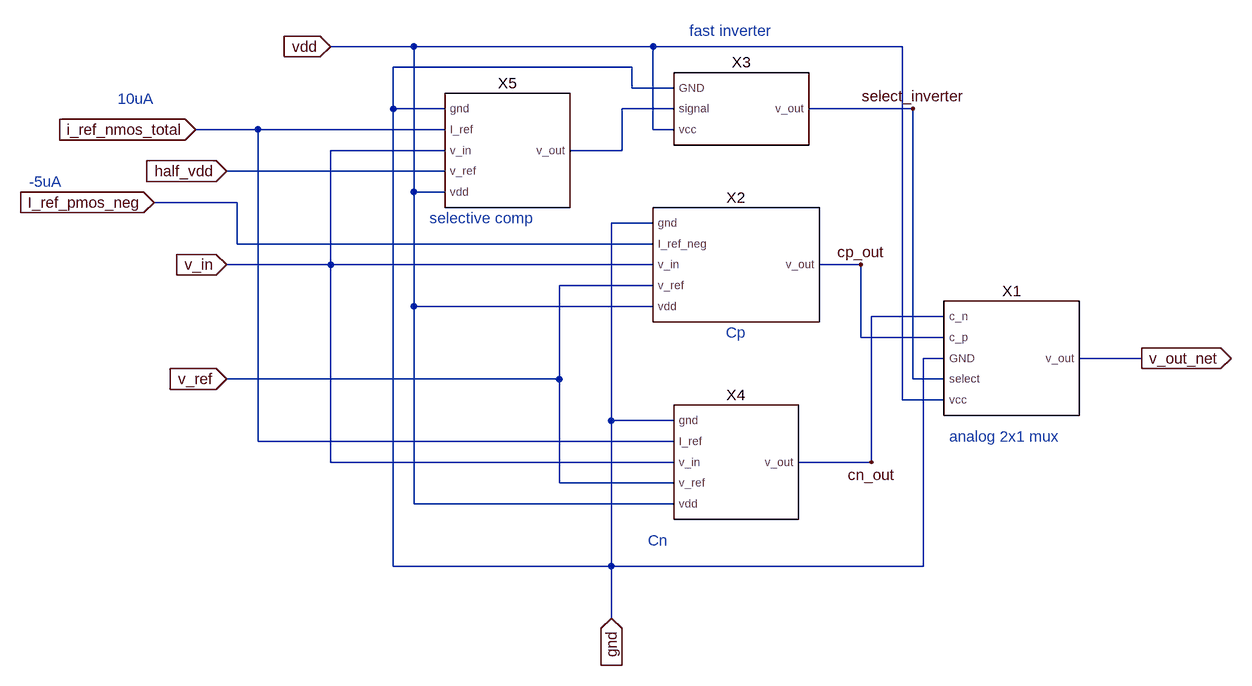
[diagram p0: schematic cp_cn_selective_comp_new_ckt.asc]
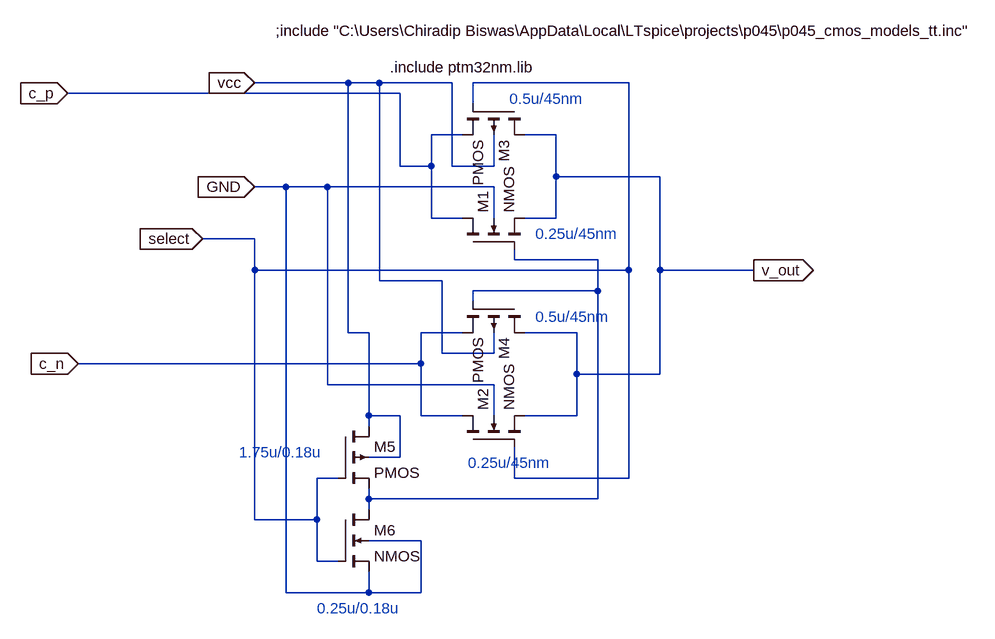
[diagram p1: sub-circuit analog_2_to_1mux.asc]
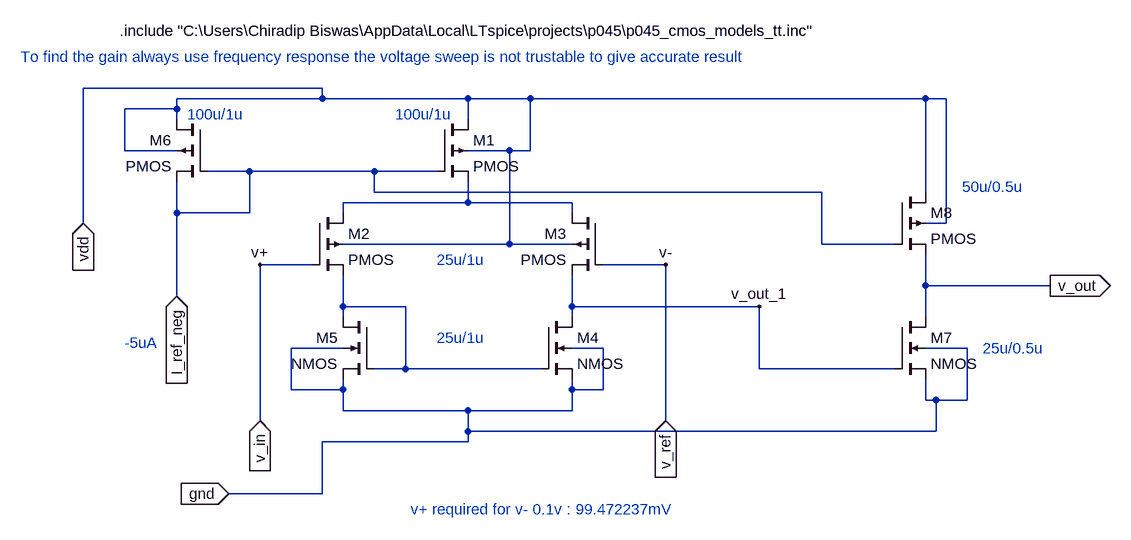
[diagram p2: sub-circuit static_comparator_pmosbased_ckt.asc]
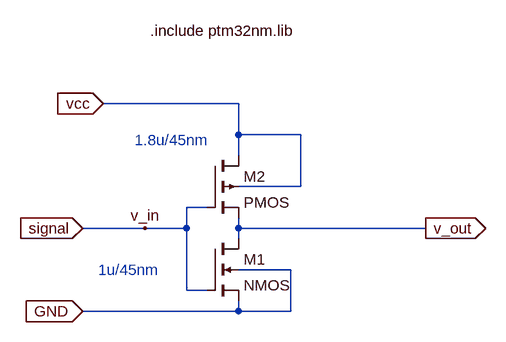
[diagram p3: sub-circuit fast_inverterckt.asc]
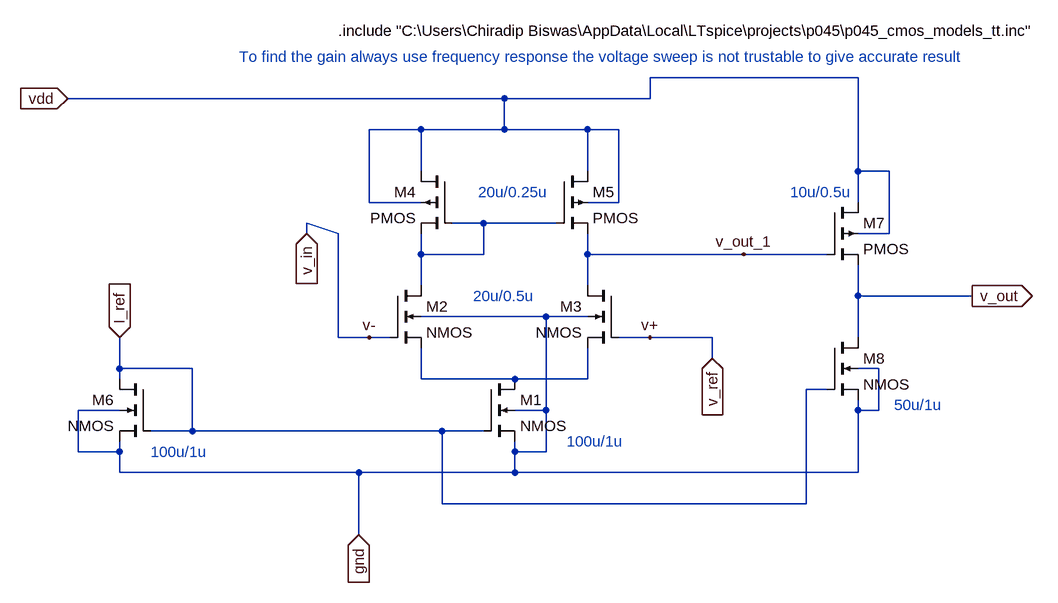
[diagram p4: sub-circuit static_comparator_nmos_based_ckt.asc]
cp_cn_selective_comp_new_ckt.asc, the LTspice schematic file:
Version 4
SHEET 1 2192 824
WIRE 896 -160 768 -160
WIRE 1264 -160 896 -160
WIRE 1648 -160 1264 -160
WIRE 1232 -128 864 -128
WIRE 1232 -96 1232 -128
WIRE 1296 -96 1232 -96
WIRE 864 -64 864 -128
WIRE 944 -64 864 -64
WIRE 1296 -64 1216 -64
WIRE 1664 -64 1504 -64
WIRE 656 -32 560 -32
WIRE 944 -32 656 -32
WIRE 1264 -32 1264 -160
WIRE 1296 -32 1264 -32
WIRE 944 0 768 0
WIRE 1216 0 1216 -64
WIRE 1216 0 1136 0
WIRE 944 32 608 32
WIRE 896 64 896 -160
WIRE 944 64 896 64
WIRE 624 80 496 80
WIRE 1264 112 1200 112
WIRE 624 144 624 80
WIRE 1264 144 624 144
WIRE 768 176 768 0
WIRE 768 176 608 176
WIRE 1264 176 768 176
WIRE 1584 176 1520 176
WIRE 1264 208 1120 208
WIRE 896 240 896 64
WIRE 1264 240 896 240
WIRE 1712 256 1600 256
WIRE 1584 288 1584 176
WIRE 1712 288 1584 288
WIRE 1712 320 1680 320
WIRE 2016 320 1920 320
WIRE 1120 352 1120 208
WIRE 1120 352 608 352
WIRE 1664 352 1664 -64
WIRE 1712 352 1664 352
WIRE 1648 384 1648 -160
WIRE 1712 384 1648 384
WIRE 1200 416 1200 112
WIRE 1296 416 1200 416
WIRE 656 448 656 -32
WIRE 1296 448 656 448
WIRE 768 480 768 176
WIRE 1296 480 768 480
WIRE 1600 480 1600 256
WIRE 1600 480 1488 480
WIRE 1120 512 1120 352
WIRE 1296 512 1120 512
WIRE 896 544 896 240
WIRE 1296 544 896 544
WIRE 864 640 864 -64
WIRE 1200 640 1200 416
WIRE 1200 640 864 640
WIRE 1680 640 1680 320
WIRE 1680 640 1200 640
WIRE 1200 720 1200 640
FLAG 768 -160 vdd
IOPIN 768 -160 In
FLAG 2016 320 v_out_net
IOPIN 2016 320 Out
FLAG 1200 720 gnd
IOPIN 1200 720 In
FLAG 560 -32 i_ref_nmos_total
IOPIN 560 -32 In
FLAG 608 32 half_vdd
IOPIN 608 32 In
FLAG 608 176 v_in
IOPIN 608 176 In
FLAG 608 352 v_ref
IOPIN 608 352 In
FLAG 496 80 I_ref_pmos_neg
IOPIN 496 80 In
FLAG 1584 176 cp_out
FLAG 1600 480 cn_out
FLAG 1664 -64 select_inverter
SYMBOL analog_2_to_1mux 1808 320 R0
SYMATTR InstName X1
SYMBOL static_comparator_pmosbased_ckt 1392 176 R0
SYMATTR InstName X2
SYMBOL fast_inverterCKT 1392 -64 R0
SYMATTR InstName X3
SYMBOL static_comparator_nmos_based_ckt 1392 480 R0
SYMATTR InstName X4
SYMBOL static_comparator_nmos_based_ckt 1040 0 R0
SYMATTR InstName X5
TEXT 1376 280 Left 2 ;Cp
TEXT 920 104 Left 2 ;selective comp
TEXT 1720 440 Left 2 ;analog 2x1 mux
TEXT 1256 600 Left 2 ;Cn
TEXT 1320 -184 Left 2 ;fast inverter
TEXT 440 -80 Left 2 ;10uA
TEXT 304 48 Left 2 ;-5uA

analog_2_to_1mux.asc, the sub-circuit schematic file:
Version 4
SHEET 1 1128 872
WIRE 32 48 -112 48
WIRE 80 48 32 48
WIRE 192 48 80 48
WIRE 464 48 224 48
WIRE 112 64 -400 64
WIRE 224 80 224 48
WIRE 208 128 160 128
WIRE 352 128 304 128
WIRE 112 176 112 64
WIRE 160 176 160 128
WIRE 160 176 112 176
WIRE 192 176 192 48
WIRE 256 176 256 128
WIRE 256 176 192 176
WIRE 352 192 352 128
WIRE 512 192 352 192
WIRE -64 208 -112 208
WIRE 0 208 -64 208
WIRE 256 208 0 208
WIRE 160 256 160 176
WIRE 208 256 160 256
WIRE 256 256 256 208
WIRE 352 256 352 192
WIRE 352 256 304 256
WIRE -112 288 -192 288
WIRE 288 320 288 304
WIRE 416 320 288 320
WIRE -112 336 -112 288
WIRE 464 336 464 48
WIRE 464 336 -112 336
WIRE 512 336 512 192
WIRE 656 336 512 336
WIRE 80 352 80 48
WIRE 176 352 80 352
WIRE 416 368 416 320
WIRE 416 368 224 368
WIRE 224 384 224 368
WIRE 32 432 32 48
WIRE 64 432 32 432
WIRE 208 432 144 432
WIRE 384 432 304 432
WIRE 176 464 176 352
WIRE 256 464 256 432
WIRE 256 464 176 464
WIRE 144 480 144 432
WIRE 144 480 -384 480
WIRE 384 496 384 432
WIRE 512 496 512 336
WIRE 512 496 384 496
WIRE 0 512 0 208
WIRE 256 512 0 512
WIRE 64 560 64 432
WIRE 112 560 64 560
WIRE 144 560 144 480
WIRE 208 560 144 560
WIRE 256 560 256 512
WIRE 384 560 384 496
WIRE 384 560 304 560
WIRE 64 576 64 560
WIRE 112 624 112 560
WIRE 112 624 64 624
WIRE 16 656 -16 656
WIRE 288 656 288 608
WIRE 464 656 464 336
WIRE 464 656 288 656
WIRE 64 688 64 672
WIRE 416 688 416 368
WIRE 416 688 64 688
WIRE 64 704 64 688
WIRE -112 720 -112 336
WIRE -16 720 -16 656
WIRE -16 720 -112 720
WIRE 144 752 64 752
WIRE -16 784 -16 720
WIRE 16 784 -16 784
WIRE -64 832 -64 208
WIRE 64 832 64 800
WIRE 64 832 -64 832
WIRE 144 832 144 752
WIRE 144 832 64 832
FLAG 656 336 v_out
IOPIN 656 336 Out
FLAG -192 288 select
IOPIN -192 288 In
FLAG -400 64 c_p
IOPIN -400 64 In
FLAG -384 480 c_n
IOPIN -384 480 In
FLAG -112 208 GND
IOPIN -112 208 In
FLAG -112 48 vcc
IOPIN -112 48 In
SYMBOL nmos4 208 304 R270
SYMATTR InstName M1
SYMATTR Value2 l=45nm w=0.25u
SYMBOL nmos4 208 608 R270
SYMATTR InstName M2
SYMATTR Value2 l=45nm w=0.25u
SYMBOL pmos4 304 80 R90
SYMATTR InstName M3
SYMATTR Value2 l=45nm w=0.5u
SYMBOL pmos4 304 384 R90
SYMATTR InstName M4
SYMATTR Value2 l=45nm w=0.5u
SYMBOL pmos4 16 576 R0
SYMATTR InstName M5
SYMATTR Value2 l=0.18u w=1.75u
SYMBOL nmos4 16 704 R0
SYMATTR InstName M6
SYMATTR Value2 l=0.18u w=0.25u
TEXT 96 24 Left 2 !.include ptm32nm.lib
TEXT 280 72 Left 2 ;0.5u/45nm
TEXT 320 408 Left 2 ;0.5u/45nm
TEXT 320 280 Left 2 ;0.25u/45nm
TEXT 216 632 Left 2 ;0.25u/45nm
TEXT -136 616 Left 2 ;1.75u/0.18u
TEXT -16 856 Left 2 ;0.25u/0.18u
TEXT -80 -32 Left 2 !;include "C:\\Users\\Chiradip Biswas\\AppData\\Local\\LTspice\\projects\\p045\\p045_cmos_models_tt.inc"

static_comparator_pmosbased_ckt.asc, the sub-circuit schematic file:
Version 4
SHEET 1 1308 712
WIRE 64 0 -304 0
WIRE 64 16 64 0
WIRE 64 16 -160 16
WIRE 288 16 64 16
WIRE 384 16 288 16
WIRE 992 16 384 16
WIRE 1024 16 992 16
WIRE -160 32 -160 16
WIRE -160 32 -240 32
WIRE -160 48 -160 32
WIRE 288 48 288 16
WIRE -240 96 -240 32
WIRE -160 96 -240 96
WIRE 352 96 288 96
WIRE 384 96 384 16
WIRE 384 96 352 96
WIRE -48 128 -112 128
WIRE 144 128 -48 128
WIRE 240 128 144 128
WIRE 144 160 144 128
WIRE 832 160 144 160
WIRE 992 160 992 16
WIRE 288 176 288 144
WIRE 288 176 96 176
WIRE 448 176 288 176
WIRE -160 192 -160 144
WIRE -48 192 -48 128
WIRE -48 192 -160 192
WIRE 96 192 96 176
WIRE 448 192 448 176
WIRE -304 208 -304 0
WIRE 1024 208 1024 16
WIRE 1024 208 992 208
WIRE 352 240 352 96
WIRE 352 240 96 240
WIRE 448 240 352 240
WIRE 832 240 832 160
WIRE 944 240 832 240
WIRE 48 272 -32 272
WIRE 592 272 496 272
WIRE 992 304 992 256
WIRE 1184 304 992 304
WIRE -160 320 -160 192
WIRE 96 336 96 288
WIRE 192 336 96 336
WIRE 448 336 448 288
WIRE 736 336 448 336
WIRE 96 352 96 336
WIRE 448 352 448 336
WIRE 992 352 992 304
WIRE 96 400 16 400
WIRE 496 400 448 400
WIRE 1056 400 992 400
WIRE 192 432 192 336
WIRE 192 432 144 432
WIRE 400 432 192 432
WIRE 736 432 736 336
WIRE 944 432 736 432
WIRE 16 464 16 400
WIRE 96 464 96 448
WIRE 96 464 16 464
WIRE 448 464 448 448
WIRE 496 464 496 400
WIRE 496 464 448 464
WIRE 992 480 992 448
WIRE 1008 480 992 480
WIRE 1056 480 1056 400
WIRE 1056 480 1008 480
WIRE 96 496 96 464
WIRE 288 496 96 496
WIRE 448 496 448 464
WIRE 448 496 288 496
WIRE -32 512 -32 272
WIRE 592 512 592 272
WIRE 288 528 288 496
WIRE 1008 528 1008 480
WIRE 1008 528 288 528
WIRE 288 544 288 528
WIRE 288 544 64 544
WIRE 64 624 64 544
WIRE 64 624 -80 624
FLAG 736 336 v_out_1
FLAG 592 272 v-
FLAG -32 272 v+
FLAG 1184 304 v_out
IOPIN 1184 304 Out
FLAG 592 512 v_ref
IOPIN 592 512 In
FLAG -32 512 v_in
IOPIN -32 512 In
FLAG -160 320 I_ref_neg
IOPIN -160 320 In
FLAG -304 208 vdd
IOPIN -304 208 In
FLAG -80 624 gnd
IOPIN -80 624 In
SYMBOL pmos4 240 48 R0
SYMATTR InstName M1
SYMATTR Value2 l=1u w=100u
SYMBOL pmos4 48 192 R0
SYMATTR InstName M2
SYMATTR Value2 l=1u w=25u
SYMBOL pmos4 496 192 M0
SYMATTR InstName M3
SYMATTR Value2 l=1u w=25u
SYMBOL nmos4 400 352 R0
SYMATTR InstName M4
SYMATTR Value2 l=1u w=25u
SYMBOL nmos4 144 352 M0
SYMATTR InstName M5
SYMATTR Value2 l=1u w=25u
SYMBOL pmos4 -112 48 M0
SYMATTR InstName M6
SYMATTR Value2 l=1u w=100u
SYMBOL nmos4 944 352 R0
SYMATTR InstName M7
SYMATTR Value2 l=0.5u w=25u
SYMBOL pmos4 944 160 R0
SYMATTR InstName M8
SYMATTR Value2 l=0.5u w=50u
TEXT -248 -88 Left 2 !.include "C:\\Users\\Chiradip Biswas\\AppData\\Local\\LTspice\\projects\\p045\\p045_cmos_models_tt.inc"
TEXT -400 -48 Left 2 ;To find the gain always use frequency response the voltage sweep is not trustable to give accurate result
TEXT 240 264 Left 2 ;25u/1u
TEXT 176 40 Left 2 ;100u/1u
TEXT -144 40 Left 2 ;100u/1u
TEXT 240 384 Left 2 ;25u/1u
TEXT 1048 152 Left 2 ;50u/0.5u
TEXT 1080 400 Left 2 ;25u/0.5u
TEXT 200 648 Left 2 ;v+ required for v- 0.1v : 99.472237mV
TEXT -240 392 Left 2 ;-5uA

fast_inverterckt.asc, the sub-circuit schematic file:
Version 4
SHEET 1 1464 680
WIRE 352 32 144 32
WIRE 352 80 352 32
WIRE 448 80 352 80
WIRE 352 112 352 80
WIRE 448 160 448 80
WIRE 448 160 352 160
WIRE 304 192 272 192
WIRE 208 224 112 224
WIRE 272 224 272 192
WIRE 272 224 208 224
WIRE 352 224 352 208
WIRE 640 224 352 224
WIRE 352 240 352 224
WIRE 432 288 352 288
WIRE 272 320 272 224
WIRE 304 320 272 320
WIRE 352 352 352 336
WIRE 352 352 112 352
WIRE 432 352 432 288
WIRE 432 352 352 352
FLAG 208 224 v_in
FLAG 144 32 vcc
IOPIN 144 32 In
FLAG 112 224 signal
IOPIN 112 224 In
FLAG 112 352 GND
IOPIN 112 352 In
FLAG 640 224 v_out
IOPIN 640 224 Out
SYMBOL nmos4 304 240 R0
SYMATTR InstName M1
SYMATTR Value2 l=45nm w=1u
SYMBOL pmos4 304 112 R0
SYMATTR InstName M2
SYMATTR Value2 l=45nm w=1.8u
TEXT 192 88 Left 2 ;1.8u/45nm
TEXT 136 288 Left 2 ;1u/45nm
TEXT 216 -80 Left 2 !.include ptm32nm.lib

static_comparator_nmos_based_ckt.asc, the sub-circuit schematic file:
Version 4
SHEET 1 1336 680
WIRE 928 -144 608 -144
WIRE 384 -112 -288 -112
WIRE 608 -112 608 -144
WIRE 608 -112 384 -112
WIRE 256 -64 176 -64
WIRE 384 -64 384 -112
WIRE 384 -64 256 -64
WIRE 512 -64 384 -64
WIRE 560 -64 512 -64
WIRE 256 0 256 -64
WIRE 512 0 512 -64
WIRE 928 0 928 -144
WIRE 976 0 928 0
WIRE 176 48 176 -64
WIRE 256 48 176 48
WIRE 560 48 560 -64
WIRE 560 48 512 48
WIRE 928 48 928 0
WIRE 352 80 304 80
WIRE 464 80 352 80
WIRE 80 96 80 80
WIRE 128 96 80 80
WIRE 976 96 976 0
WIRE 976 96 928 96
WIRE 256 128 256 96
WIRE 352 128 352 80
WIRE 352 128 256 128
WIRE 512 128 512 96
WIRE 752 128 512 128
WIRE 880 128 752 128
WIRE 256 176 256 128
WIRE 512 176 512 128
WIRE 928 192 928 144
WIRE 1104 192 928 192
WIRE 448 224 256 224
WIRE 512 224 448 224
WIRE 128 256 128 96
WIRE 176 256 128 256
WIRE 208 256 176 256
WIRE 608 256 560 256
WIRE 704 256 608 256
WIRE 928 256 928 192
WIRE 704 288 704 256
WIRE -208 304 -208 256
WIRE -96 304 -208 304
WIRE 960 304 928 304
WIRE -208 320 -208 304
WIRE 256 320 256 272
WIRE 400 320 256 320
WIRE 512 320 512 272
WIRE 512 320 400 320
WIRE 880 336 848 336
WIRE -208 368 -272 368
WIRE 448 368 448 224
WIRE 448 368 400 368
WIRE 928 368 928 352
WIRE 960 368 960 304
WIRE 960 368 928 368
WIRE -96 400 -96 304
WIRE -96 400 -160 400
WIRE 288 400 -96 400
WIRE 352 400 288 400
WIRE -272 432 -272 368
WIRE -208 432 -208 416
WIRE -208 432 -272 432
WIRE 400 432 400 416
WIRE 448 432 448 368
WIRE 448 432 400 432
WIRE -208 464 -208 432
WIRE 160 464 -208 464
WIRE 400 464 400 432
WIRE 400 464 160 464
WIRE 928 464 928 368
WIRE 928 464 400 464
WIRE 288 512 288 400
WIRE 848 512 848 336
WIRE 848 512 288 512
WIRE 160 560 160 464
FLAG 608 256 v+
FLAG 176 256 v-
FLAG 752 128 v_out_1
FLAG 1104 192 v_out
IOPIN 1104 192 Out
FLAG 704 288 v_ref
IOPIN 704 288 In
FLAG 80 96 v_in
IOPIN 80 96 In
FLAG -288 -112 vdd
IOPIN -288 -112 In
FLAG -208 256 I_ref
IOPIN -208 256 In
FLAG 160 560 gnd
IOPIN 160 560 In
SYMBOL nmos4 352 320 R0
SYMATTR InstName M1
SYMATTR Value2 l=1u w=100u
SYMBOL nmos4 208 176 R0
SYMATTR InstName M2
SYMATTR Value2 l=0.5u w=20u
SYMBOL nmos4 560 176 M0
SYMATTR InstName M3
SYMATTR Value2 l=0.5u w=20u
SYMBOL pmos4 304 0 M0
SYMATTR InstName M4
SYMATTR Value2 l=0.25u w=20u
SYMBOL pmos4 464 0 R0
SYMATTR InstName M5
SYMATTR Value2 l=0.25u w=20u
SYMBOL nmos4 -160 320 M0
SYMATTR InstName M6
SYMATTR Value2 l=1u w=100u
SYMBOL pmos4 880 48 R0
SYMATTR InstName M7
SYMATTR Value2 l=0.5u w=10u
SYMBOL nmos4 880 256 R0
SYMATTR InstName M8
SYMATTR Value2 l=0.5u w=50u
TEXT 128 -216 Left 2 !.include "C:\\Users\\Chiradip Biswas\\AppData\\Local\\LTspice\\projects\\p045\\p045_cmos_models_tt.inc"
TEXT 480 416 Left 2 ;100u/1u
TEXT 344 32 Left 2 ;20u/0.25u
TEXT 336 192 Left 2 ;20u/0.5u
TEXT -160 432 Left 2 ;100u/1u
TEXT 824 32 Left 2 ;10u/0.5u
TEXT 984 360 Left 2 ;50u/1u
TEXT -24 -176 Left 2 ;To find the gain always use frequency response the voltage sweep is not trustable to give accurate result

The netlist it stands for:
* cp_cn_selective_comp_new_ckt.asc
XX1 cn_out cp_out gnd select_inverter vdd v_out_net analog_2_to_1mux
XX2 gnd I_ref_pmos_neg v_in v_ref vdd cp_out static_comparator_pmosbased_ckt
XX3 gnd N001 vdd select_inverter fast_inverterckt
XX4 gnd i_ref_nmos_total v_in v_ref vdd cn_out static_comparator_nmos_based_ckt
XX5 gnd i_ref_nmos_total v_in half_vdd vdd N001 static_comparator_nmos_based_ckt

* block symbol definitions
.subckt analog_2_to_1mux c_n c_p GND select vcc v_out
M1 c_p N001 v_out GND NMOS l=45nm w=0.25u
M2 c_n select v_out GND NMOS l=45nm w=0.25u
M3 v_out select c_p vcc PMOS l=45nm w=0.5u
M4 v_out N001 c_n vcc PMOS l=45nm w=0.5u
M5 vcc select N001 vcc PMOS l=0.18u w=1.75u
M6 N001 select GND GND NMOS l=0.18u w=0.25u
.include ptm32nm.lib
* 0.5u/45nm
* 0.5u/45nm
* 0.25u/45nm
* 0.25u/45nm
* 1.75u/0.18u
* 0.25u/0.18u
;include "C:\Users\Chiradip Biswas\AppData\Local\LTspice\projects\p045\p045_cmos_models_tt.inc"
.ends analog_2_to_1mux

.subckt static_comparator_pmosbased_ckt gnd I_ref_neg v_in v_ref vdd v_out
M1 vdd I_ref_neg N001 vdd PMOS l=1u w=100u
M2 N001 v_in N002 vdd PMOS l=1u w=25u
M3 N001 v_ref v_out_1 vdd PMOS l=1u w=25u
M4 v_out_1 N002 gnd gnd NMOS l=1u w=25u
M5 N002 N002 gnd gnd NMOS l=1u w=25u
M6 vdd I_ref_neg I_ref_neg vdd PMOS l=1u w=100u
M7 v_out v_out_1 gnd gnd NMOS l=0.5u w=25u
M8 vdd I_ref_neg v_out vdd PMOS l=0.5u w=50u
.include "C:\Users\Chiradip Biswas\AppData\Local\LTspice\projects\p045\p045_cmos_models_tt.inc"
* To find the gain always use frequency response the voltage sweep is not trustable to give accurate result
* 25u/1u
* 100u/1u
* 100u/1u
* 25u/1u
* 50u/0.5u
* 25u/0.5u
* v+ required for v- 0.1v : 99.472237mV
* -5uA
.ends static_comparator_pmosbased_ckt

.subckt fast_inverterckt GND signal vcc v_out
M1 v_out signal GND GND NMOS l=45nm w=1u
M2 vcc signal v_out vcc PMOS l=45nm w=1.8u
* 1.8u/45nm
* 1u/45nm
.include ptm32nm.lib
.ends fast_inverterckt

.subckt static_comparator_nmos_based_ckt gnd I_ref v_in v_ref vdd v_out
M1 N002 I_ref gnd gnd NMOS l=1u w=100u
M2 N001 v_in N002 gnd NMOS l=0.5u w=20u
M3 v_out_1 v_ref N002 gnd NMOS l=0.5u w=20u
M4 vdd N001 N001 vdd PMOS l=0.25u w=20u
M5 vdd N001 v_out_1 vdd PMOS l=0.25u w=20u
M6 I_ref I_ref gnd gnd NMOS l=1u w=100u
M7 vdd v_out_1 v_out vdd PMOS l=0.5u w=10u
M8 v_out I_ref gnd gnd NMOS l=0.5u w=50u
.include "C:\Users\Chiradip Biswas\AppData\Local\LTspice\projects\p045\p045_cmos_models_tt.inc"
* 100u/1u
* 20u/0.25u
* 20u/0.5u
* 100u/1u
* 10u/0.5u
* 50u/1u
* To find the gain always use frequency response the voltage sweep is not trustable to give accurate result
.ends static_comparator_nmos_based_ckt

.model NMOS NMOS
.model PMOS PMOS
.lib standard.mos
* Cp
* selective comp
* analog 2x1 mux
* Cn
* fast inverter
* 10uA
* -5uA
.backanno
.end